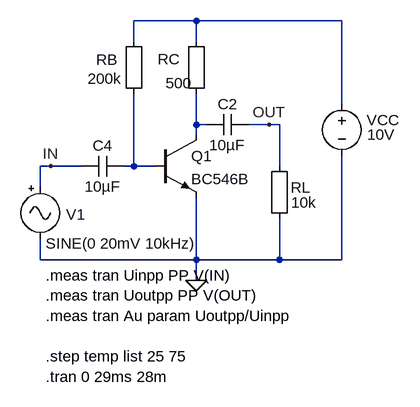
[diagram p0: schematic BT-CE-AMP-3.asc]
BT-CE-AMP-3.asc, the LTspice schematic file:
Version 4
SHEET 1 880 680
WIRE 192 -64 96 -64
WIRE 416 -64 192 -64
WIRE 96 -32 96 -64
WIRE 192 -32 192 -64
WIRE 416 64 416 -64
WIRE 192 96 192 48
WIRE 208 96 192 96
WIRE 304 96 272 96
WIRE 320 96 304 96
WIRE 192 112 192 96
WIRE -32 160 -48 160
WIRE 16 160 -32 160
WIRE 96 160 96 48
WIRE 96 160 80 160
WIRE 128 160 96 160
WIRE 320 160 320 96
WIRE -48 192 -48 160
WIRE -48 304 -48 272
WIRE 192 304 192 208
WIRE 192 304 -48 304
WIRE 320 304 320 240
WIRE 320 304 192 304
WIRE 416 304 416 144
WIRE 416 304 320 304
WIRE 192 336 192 304
FLAG 192 336 0
FLAG -32 160 IN
FLAG 304 96 OUT
SYMBOL npn 128 112 R0
SYMATTR InstName Q1
SYMATTR Value BC546B
SYMBOL Misc\\EuropeanResistor 80 -48 R0
WINDOW 0 -42 44 Left 2
WINDOW 3 -55 73 Left 2
SYMATTR InstName RB
SYMATTR Value 200k
SYMBOL Misc\\EuropeanResistor 176 -48 R0
WINDOW 0 -43 43 Left 2
WINDOW 3 -31 80 Left 2
SYMATTR InstName RC
SYMATTR Value 500
SYMBOL Misc\\signal -48 176 R0
WINDOW 123 0 0 Left 2
WINDOW 0 40 58 Left 2
WINDOW 3 8 103 Left 2
SYMATTR InstName V1
SYMATTR Value SINE(0 20mV 10kHz)
SYMBOL voltage 416 48 R0
WINDOW 0 38 41 Left 2
WINDOW 3 39 63 Left 2
WINDOW 123 0 0 Left 2
WINDOW 39 0 0 Left 2
SYMATTR InstName VCC
SYMATTR Value 10V
SYMBOL cap 80 144 R90
WINDOW 0 0 32 VBottom 2
WINDOW 3 32 32 VTop 2
SYMATTR InstName C4
SYMATTR Value 10µF
SYMBOL cap 272 80 R90
WINDOW 0 0 32 VBottom 2
WINDOW 3 32 32 VTop 2
SYMATTR InstName C2
SYMATTR Value 10µF
SYMBOL Misc\\EuropeanResistor 304 144 R0
WINDOW 0 33 49 Left 2
WINDOW 3 34 72 Left 2
SYMATTR InstName RL
SYMATTR Value 10k
TEXT -40 328 Left 2 !.meas tran Uinpp PP V(IN)\n.meas tran Uoutpp PP V(OUT)\n.meas tran Au param Uoutpp/Uinpp\n \n.step temp list 25 75\n.tran 0 29ms 28m

The netlist it stands for:
* BT-CE-AMP-3.asc
Q1 N002 N003 0 0 BC546B
RB N001 N003 200k
RC N001 N002 500
V1 IN 0 SINE(0 20mV 10kHz)
VCC N001 0 10V
C4 N003 IN 10µF
C2 OUT N002 10µF
RL OUT 0 10k
.model NPN NPN
.model PNP PNP
.lib standard.bjt
.meas tran Uinpp PP V(IN)
.meas tran Uoutpp PP V(OUT)
.meas tran Au param Uoutpp/Uinpp
.step temp list 25 75
.tran 0 29ms 28m
.backanno
.end